# Altium schematic sheet PVC.SchDoc
size A
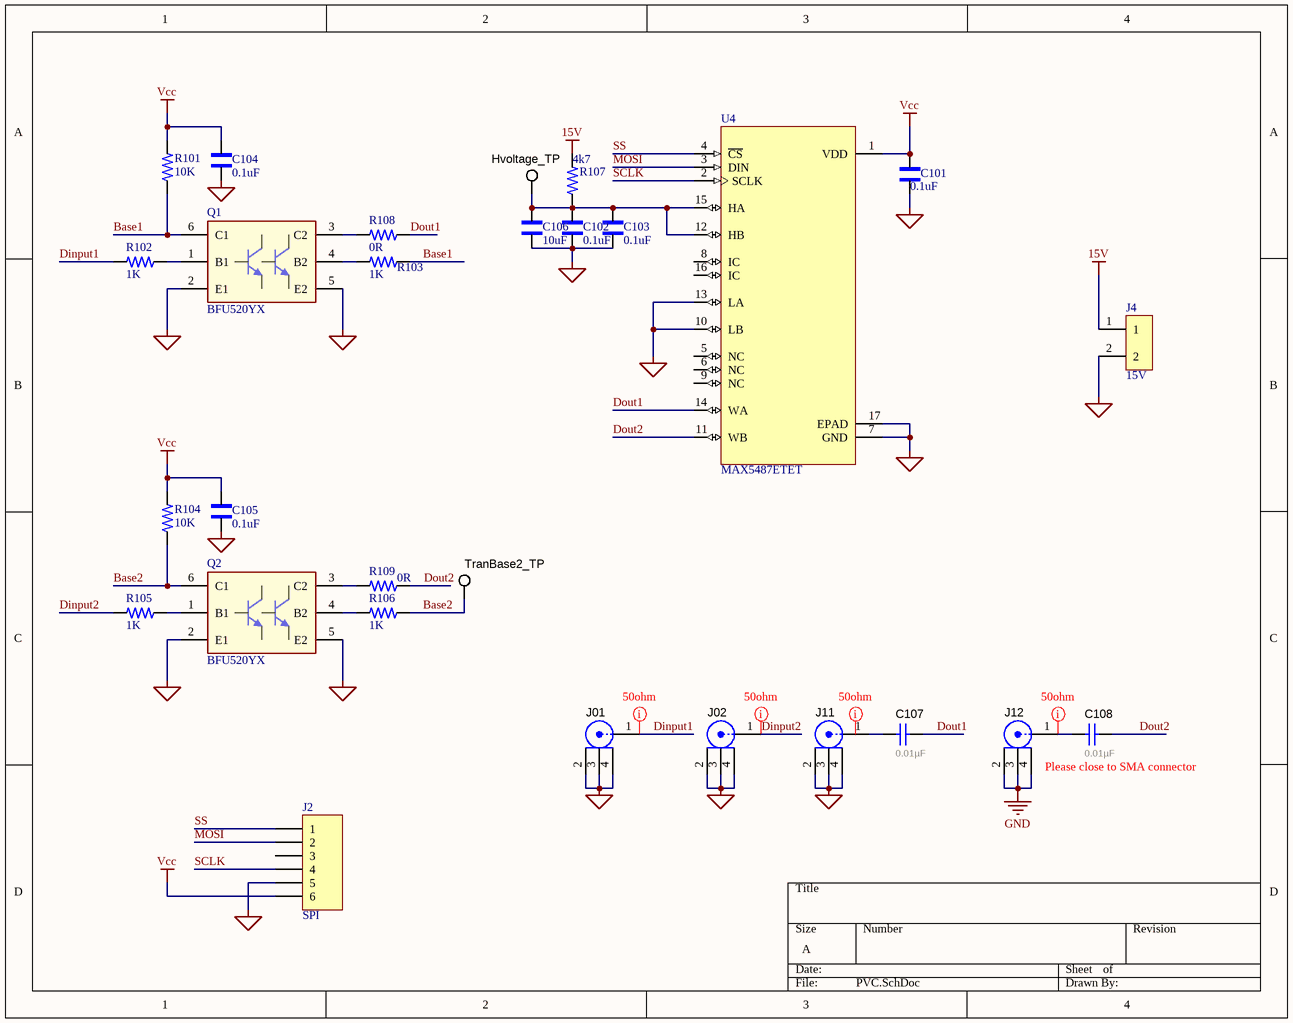
[diagram p0: PVC.SchDoc]

## Parts
C101  value 0.1uF  [C0402]  (hidden comment: C0402)
C102  value 0.1uF  [C0402]  (hidden comment: C0402)
C103  value 0.1uF  [C0402]  (hidden comment: C0402)
C104  value 0.1uF  [C0402]  (hidden comment: C0402)
C105  value 0.1uF  [C0402]  (hidden comment: C0402)
C106  value 10uF  [0805]  (hidden comment: C0805)
C107  ValueDisplayed: 0.01µF  [C0402]  (hidden comment: 520L103KT16T)
C108  ValueDisplayed: 0.01µF  [C0402]  (hidden comment: 520L103KT16T)
Hvoltage_TP  5007  [Keystone5007]  (value not drawn)
J01  142-0771-831  [Johnson_142-0771-831]  (value not drawn)
J02  142-0771-831  [Johnson_142-0771-831]  (value not drawn)
J2  SPI  [61300611121]
J4  15V  [PHOENIX_1935161]
J11  142-0771-831  [Johnson_142-0771-831]  (value not drawn)
J12  142-0771-831  [Johnson_142-0771-831]  (value not drawn)
Q1  BFU520YX  [SOT363-EXT]
Q2  BFU520YX  [SOT363-EXT]
R101  value 10K  [R0402]  (hidden comment: R0402)
R102  value 1K  [R0402]  (hidden comment: R0402)
R103  value 1K  [R0402]  (hidden comment: R0402)
R104  value 10K  [R0402]  (hidden comment: R0402)
R105  value 1K  [R0402]  (hidden comment: R0402)
R106  value 1K  [R0402]  (hidden comment: R0402)
R107  value 4k7  [R0402]  (hidden comment: R0402)
R108  value 0R  [R0402]  (hidden comment: R0402)
R109  value 0R  [R0402]  (hidden comment: R0402)
TranBase2_TP  5007  [Keystone5007]  (value not drawn)
U4  MAX5487ETET  [QFN50P300X300X80-17N - duplicate]

## Nets
15V: J4.1 R107.2
GND: C101.1 C102.2 C103.2 C104.2 C105.2 C106.2 J01.2 J01.3 J01.4 J02.2 J02.3 J02.4 J2.5 J4.2 J11.2 J11.3 J11.4 J12.2 J12.3 J12.4 Q1.2(E1) Q1.5(E2) Q2.2(E1) Q2.5(E2) U4.7(GND) U4.10(LB) U4.13(LA) U4.17(EPAD)
Vcc: C101.2 C104.1 C105.1 J2.6 R101.2 R104.2 U4.1(VDD)
Base1: Q1.6(C1) R101.1 R103.1
Base2: Q2.6(C1) R104.1 R106.1 TranBase2_TP.1
Dinput1: J01.1 R102.2
Dinput2: J02.1 R105.2
Dout1: C107.1 R108.1 U4.14(WA)
Dout2: C108.1 R109.1 U4.11(WB)
MOSI: J2.2 U4.3(DIN)
SCLK: J2.4 U4.2(SCLK)
SS: J2.1 U4.4(~{CS})
NetC102_1: C102.1 C103.1 C106.1 Hvoltage_TP.1 R107.1 U4.12(HB) U4.15(HA)
NetC107_2: C107.2 J11.1
NetC108_2: C108.2 J12.1
NetQ1_1: Q1.1(B1) R102.1
NetQ1_3: Q1.3(C2) R108.2
NetQ1_4: Q1.4(B2) R103.2
NetQ2_1: Q2.1(B1) R105.1
NetQ2_3: Q2.3(C2) R109.2
NetQ2_4: Q2.4(B2) R106.2

Not connected (* = marked no-connect by the designer): J2 3; U4 5(NC) 6(NC) 8(IC) 9(NC) 16(IC)

## Layout directives
mark named 50ohm: (no net found under the mark), Dinput1, Dinput2, NetC108_2

## Notes on the sheet
- Please close to SMA connector

## Library data of the parts
C101-C105 = C0402: CAP CER 0.1UF 16V X7R 0402; Manufacturer: Murata Electronics; Manufacturer Part Number: GCM155R71C104JA55D; Package: C0402; Digi-Key Part Number: 490-16433-1-ND
C106 = C0402: CAP CER 10UF 16V X5R 0805; Manufacturer: Samsung Electro-Mechanics
C107 C108 = 520L103KT16T: CAP, CERM, 0.01 µF, 16 V, +/- 10%, X7R, 0402; Manufacturer: AT Ceramics; Polarized: N; CompType: Capacitor; Value: 0.01uF; U/M: EA; Cap_F: 0.00000001; Tolerance_%: 10; Value1: Unknown; VDC_V: 16; Value2: 16V; TaMin_C: -55; TaMax_C: 125; Cap_Case: 0402; AEC Category: Q200; SizeArea_mm2: 0.5; SizeAreaWB_mm2: 3; SizeX_mm: 1; SizeZ_mm: 0.65; SymbolVersion: 2008-07-09; PartNumber: 520L103KT16T; PackageReference: 0402; RoHS: Y; MountType: SMT; Technology: Ceramic; TempCo: X7R; Published: 2008-06-19; Publisher: Texas Instruments; LatestRevisionDate: 2016-06-23; ComponentLink1Description: Datasheet link; ComponentLink1URL: https://www.atceramics.com/UserFiles/520l.pdf; Supplier 1: Digi-Key; Supplier Part Number 1: 1284-1540-1-ND; Supplier 2: Mouser; Supplier Part Number 2: 581-520L103KT16T; AEC Qualified: N; AEC Grade: N/A; SizeY_mm: 0.5
Hvoltage_TP TranBase2_TP = 5007: Test Point, Compact, White, TH; Manufacturer: Keystone; CompType: Test Point Loop; U/M: EA; SymbolVersion: 2008-04-04; PartNumber: 5007; Value: White; RoHS: Y; PackageReference: White Compact Testpoint; MountType: TH; ComponentLink1Description: Datasheet Link; ComponentLink1URL: http://www.keyelco.com/userAssets/file/M60-2p60.pdf; Publisher: Texas Instruments; LatestRevisionDate: 2013-07-19; Supplier 1: Digi-Key; Supplier Part Number 1: 5007K-ND
J01 J02 J11 J12 = 142-0771-831: JACK, SMA, 50 Ohm, Gold, Edge Mount; Manufacturer: Johnson; SymbolCreator: Altium; Gender: Female; Voltage_V: 170; SymbolVersion: 2016-06-06; PartNumber: 142-0771-831; PackageReference: JACK, SMA, 50 Ohm, Gold, Edge Mount; CompType: Jack; RoHS: Y; MountType: SMT; ComponentLink1Description: Datasheet URL; ComponentLink1URL: https://cinchconnectivity.com/OA_MEDIA/drawings/dr-142-0771-831.pdf; Orientation: R/A; ContactFinish: Gold; Color: Gold; Publisher: Texas Instruments; LatestRevisionDate: 2016-11-22; Supplier 1: Digi-Key; Supplier Part Number 1: J808-ND; Supplier 2: Mouser; Supplier Part Number 2: 530-142-0771-831
J2 = Header 6: CONN HEADER VERT 6POS 2.54MM; Manufacturer: Würth Elektronik; Manufacturer Part Number: 61300611121; Digi-Key Part Number: 732-5319-ND
J4 = 1935161: 2 Position Wire to Board Terminal Block Horizontal with Board 0.197 _5.00mm_ Through Hole; MF: Phoenix Contact; SnapEDA_Link: https://www.snapeda.com/parts/1935161/Phoenix%20Contact/view-part/423515/?ref=snap; MP: 1935161; Value: *; Digi-Key_Purchase_URL: https://www.digikey.ca/product-detail/en/phoenix-contact/1935161/277-1667-ND/568614?utm_source=snapeda&utm_medium=aggregator&utm_campaign=symbol; Digi-Key_Part_Number: 277-1667-ND; Package: None
Q1 Q2 = BFU520YX: RF TRANS 2 NPN 12V 10GHZ SOT363; Manufacturer: NXP USA Inc.; Manufacturer Part Number: BFU520YX; Digi-Key Part Number: 568-11508-1-ND
R101 R104 = R0402: RES SMD 10K OHM 0.1% 1/16W 0402; Manufacturer: Yageo; Manufacturer Part Number: RT0402BRD0710KL; Tolerance: 0.1%; Package: 0402; Digi-Key Part Number: YAG1346CT-ND
R102 R103 R105 R106 = R0402: RES SMD 1K OHM 1% 1/16W 0402; Manufacturer: Yageo; Manufacturer Part Number: RC0402FR-071KL; Tolerance: 0.1%; Package: 0402; Digi-Key Part Number: 311-1.00KLRCT-ND
R107 = R0402: Manufacturer: Yageo; Manufacturer Part Number: RC0402FR-074K7L; Tolerance: 1%; Package: 0402; Digi-Key Part Number: 311-4.7KLRCT-ND
R108 R109 = R0402: RES SMD 0 OHM JUMPER 1/16W 0402; Manufacturer: Yageo; Manufacturer Part Number: AC0402JR-070RL; Tolerance: 0.1%; Package: 0402; Digi-Key Part Number: 311-1.00KLRCT-ND
U4 = MAX5487ETET: Digital Potentiometer 10k Ohm 2 Circuit 256 Taps SPI Interface 16-TQFN (3x3); Manufacturer: Maxim Integrated; Manufacturer Part Number: MAX5487ETE+T; Value: *; Package: QFN-16 Maxim; Digi-Key Part Number: MAX5487ETE+TCT-ND